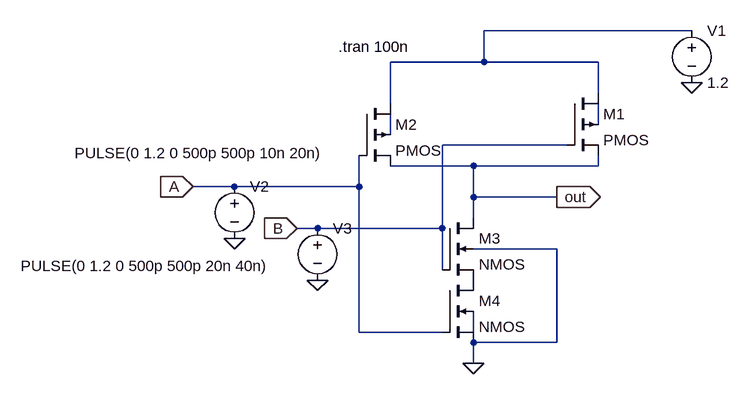
[diagram p0: schematic NAND.asc]
NAND.asc, the LTspice schematic file:
Version 4.1
SHEET 1 880 680
WIRE 496 -48 176 -48
WIRE 176 0 176 -48
WIRE 176 0 32 0
WIRE 352 0 176 0
WIRE 352 48 352 0
WIRE 32 64 32 0
WIRE 352 96 352 64
WIRE 32 112 32 80
WIRE 304 128 112 128
WIRE 160 160 32 160
WIRE 352 160 352 144
WIRE 352 160 160 160
WIRE -208 192 -272 192
WIRE -16 192 -16 144
WIRE -16 192 -208 192
WIRE 160 208 160 160
WIRE 288 208 160 208
WIRE 160 240 160 208
WIRE -80 256 -112 256
WIRE 112 256 112 128
WIRE 112 256 -80 256
WIRE 288 288 160 288
WIRE 112 320 112 256
WIRE -16 416 -16 192
WIRE 112 416 -16 416
WIRE 160 416 160 384
WIRE 288 432 288 288
WIRE 288 432 160 432
WIRE 160 464 160 432
FLAG 160 464 0
FLAG -208 272 0
FLAG -80 336 0
FLAG 496 32 0
FLAG -272 192 A
IOPIN -272 192 In
FLAG -112 256 B
IOPIN -112 256 In
FLAG 288 208 out
IOPIN 288 208 Out
SYMBOL pmos4 304 48 R0
SYMATTR InstName M1
SYMBOL pmos4 -16 64 R0
SYMATTR InstName M2
SYMBOL nmos4 112 240 R0
SYMATTR InstName M3
SYMBOL nmos4 112 336 R0
SYMATTR InstName M4
SYMBOL voltage 496 -64 R0
WINDOW 123 0 0 Left 0
WINDOW 39 0 0 Left 0
SYMATTR InstName V1
SYMATTR Value 1.2
SYMBOL voltage -208 176 R0
WINDOW 3 -246 -36 Left 2
WINDOW 123 0 0 Left 0
WINDOW 39 0 0 Left 0
SYMATTR Value PULSE(0 1.2 0 500p 500p 10n 20n)
SYMATTR InstName V2
SYMBOL voltage -80 240 R0
WINDOW 3 -457 74 Left 2
WINDOW 123 0 0 Left 0
WINDOW 39 0 0 Left 0
SYMATTR Value PULSE(0 1.2 0 500p 500p 20n 40n)
SYMATTR InstName V3
TEXT -48 -24 Left 2 !.tran 100n

The netlist it stands for:
* NAND.asc
M1 N001 B out N002 PMOS
M2 N001 A out N003 PMOS
M3 out B P001 0 NMOS
M4 P001 A 0 N004 NMOS
V1 N001 0 1.2
V2 A 0 PULSE(0 1.2 0 500p 500p 10n 20n)
V3 B 0 PULSE(0 1.2 0 500p 500p 20n 40n)
.model NMOS NMOS
.model PMOS PMOS
.lib standard.mos
.tran 100n
.backanno
.end